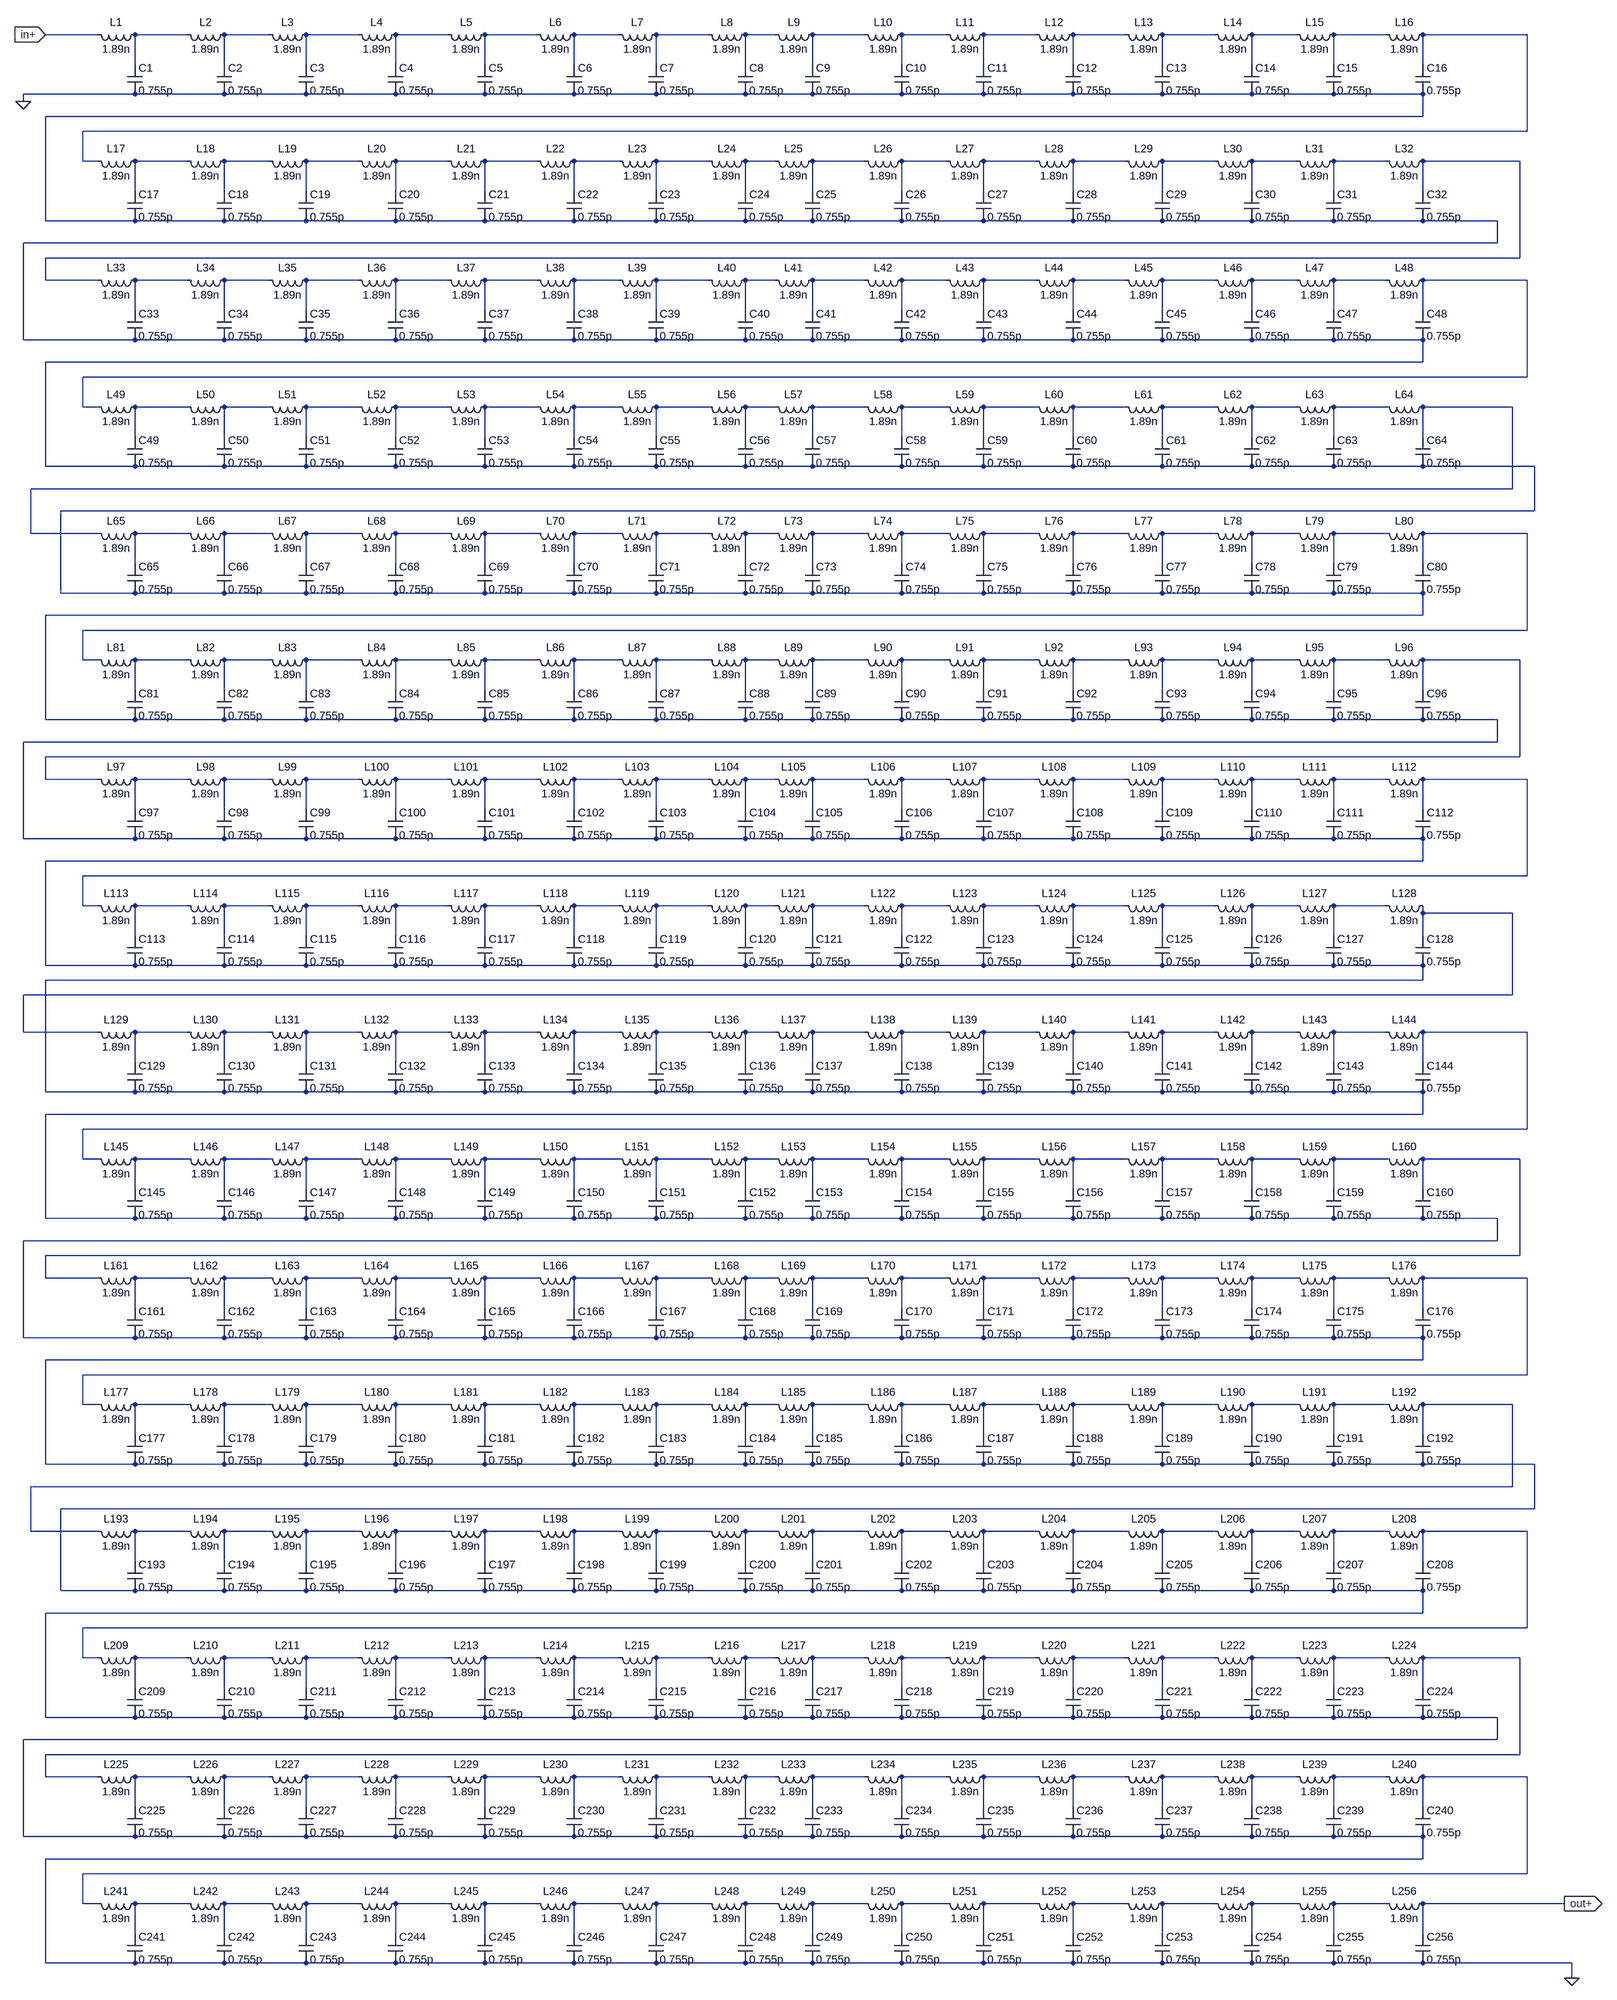
[diagram p0: schematic 10ns-delay.asc]
* 10ns-delay.asc
L1 N001 in+ 1.89n
C1 N001 0 0.755p
L2 N002 N001 1.89n
C2 N002 0 0.755p
L3 N003 N002 1.89n
C3 N003 0 0.755p
L4 N004 N003 1.89n
C4 N004 0 0.755p
L5 N005 N004 1.89n
C5 N005 0 0.755p
L6 N006 N005 1.89n
C6 N006 0 0.755p
L7 N007 N006 1.89n
C7 N007 0 0.755p
L8 N008 N007 1.89n
C8 N008 0 0.755p
L9 N009 N008 1.89n
C9 N009 0 0.755p
L10 N010 N009 1.89n
C10 N010 0 0.755p
L11 N011 N010 1.89n
C11 N011 0 0.755p
L12 N012 N011 1.89n
C12 N012 0 0.755p
L13 N013 N012 1.89n
C13 N013 0 0.755p
L14 N014 N013 1.89n
C14 N014 0 0.755p
L15 N015 N014 1.89n
C15 N015 0 0.755p
L16 N016 N015 1.89n
C16 N016 0 0.755p
L17 N017 N016 1.89n
C17 N017 0 0.755p
L18 N018 N017 1.89n
C18 N018 0 0.755p
L19 N019 N018 1.89n
C19 N019 0 0.755p
L20 N020 N019 1.89n
C20 N020 0 0.755p
L21 N021 N020 1.89n
C21 N021 0 0.755p
L22 N022 N021 1.89n
C22 N022 0 0.755p
L23 N023 N022 1.89n
C23 N023 0 0.755p
L24 N024 N023 1.89n
C24 N024 0 0.755p
L25 N025 N024 1.89n
C25 N025 0 0.755p
L26 N026 N025 1.89n
C26 N026 0 0.755p
L27 N027 N026 1.89n
C27 N027 0 0.755p
L28 N028 N027 1.89n
C28 N028 0 0.755p
L29 N029 N028 1.89n
C29 N029 0 0.755p
L30 N030 N029 1.89n
C30 N030 0 0.755p
L31 N031 N030 1.89n
C31 N031 0 0.755p
L32 N032 N031 1.89n
C32 N032 0 0.755p
L33 N033 N032 1.89n
C33 N033 0 0.755p
L34 N034 N033 1.89n
C34 N034 0 0.755p
L35 N035 N034 1.89n
C35 N035 0 0.755p
L36 N036 N035 1.89n
C36 N036 0 0.755p
L37 N037 N036 1.89n
C37 N037 0 0.755p
L38 N038 N037 1.89n
C38 N038 0 0.755p
L39 N039 N038 1.89n
C39 N039 0 0.755p
L40 N040 N039 1.89n
C40 N040 0 0.755p
L41 N041 N040 1.89n
C41 N041 0 0.755p
L42 N042 N041 1.89n
C42 N042 0 0.755p
L43 N043 N042 1.89n
C43 N043 0 0.755p
L44 N044 N043 1.89n
C44 N044 0 0.755p
L45 N045 N044 1.89n
C45 N045 0 0.755p
L46 N046 N045 1.89n
C46 N046 0 0.755p
L47 N047 N046 1.89n
C47 N047 0 0.755p
L48 N048 N047 1.89n
C48 N048 0 0.755p
L49 N049 N048 1.89n
C49 N049 0 0.755p
L50 N050 N049 1.89n
C50 N050 0 0.755p
L51 N051 N050 1.89n
C51 N051 0 0.755p
L52 N052 N051 1.89n
C52 N052 0 0.755p
L53 N053 N052 1.89n
C53 N053 0 0.755p
L54 N054 N053 1.89n
C54 N054 0 0.755p
L55 N055 N054 1.89n
C55 N055 0 0.755p
L56 N056 N055 1.89n
C56 N056 0 0.755p
L57 N057 N056 1.89n
C57 N057 0 0.755p
L58 N058 N057 1.89n
C58 N058 0 0.755p
L59 N059 N058 1.89n
C59 N059 0 0.755p
L60 N060 N059 1.89n
C60 N060 0 0.755p
L61 N061 N060 1.89n
C61 N061 0 0.755p
L62 N062 N061 1.89n
C62 N062 0 0.755p
L63 N063 N062 1.89n
C63 N063 0 0.755p
L64 N064 N063 1.89n
C64 N064 0 0.755p
L65 N065 N064 1.89n
C65 N065 0 0.755p
L66 N066 N065 1.89n
C66 N066 0 0.755p
L67 N067 N066 1.89n
C67 N067 0 0.755p
L68 N068 N067 1.89n
C68 N068 0 0.755p
L69 N069 N068 1.89n
C69 N069 0 0.755p
L70 N070 N069 1.89n
C70 N070 0 0.755p
L71 N071 N070 1.89n
C71 N071 0 0.755p
L72 N072 N071 1.89n
C72 N072 0 0.755p
L73 N073 N072 1.89n
C73 N073 0 0.755p
L74 N074 N073 1.89n
C74 N074 0 0.755p
L75 N075 N074 1.89n
C75 N075 0 0.755p
L76 N076 N075 1.89n
C76 N076 0 0.755p
L77 N077 N076 1.89n
C77 N077 0 0.755p
L78 N078 N077 1.89n
C78 N078 0 0.755p
L79 N079 N078 1.89n
C79 N079 0 0.755p
L80 N080 N079 1.89n
C80 N080 0 0.755p
L81 N081 N080 1.89n
C81 N081 0 0.755p
L82 N082 N081 1.89n
C82 N082 0 0.755p
L83 N083 N082 1.89n
C83 N083 0 0.755p
L84 N084 N083 1.89n
C84 N084 0 0.755p
L85 N085 N084 1.89n
C85 N085 0 0.755p
L86 N086 N085 1.89n
C86 N086 0 0.755p
L87 N087 N086 1.89n
C87 N087 0 0.755p
L88 N088 N087 1.89n
C88 N088 0 0.755p
L89 N089 N088 1.89n
C89 N089 0 0.755p
L90 N090 N089 1.89n
C90 N090 0 0.755p
L91 N091 N090 1.89n
C91 N091 0 0.755p
L92 N092 N091 1.89n
C92 N092 0 0.755p
L93 N093 N092 1.89n
C93 N093 0 0.755p
L94 N094 N093 1.89n
C94 N094 0 0.755p
L95 N095 N094 1.89n
C95 N095 0 0.755p
L96 N096 N095 1.89n
C96 N096 0 0.755p
L97 N097 N096 1.89n
C97 N097 0 0.755p
L98 N098 N097 1.89n
C98 N098 0 0.755p
L99 N099 N098 1.89n
C99 N099 0 0.755p
L100 N100 N099 1.89n
C100 N100 0 0.755p
L101 N101 N100 1.89n
C101 N101 0 0.755p
L102 N102 N101 1.89n
C102 N102 0 0.755p
L103 N103 N102 1.89n
C103 N103 0 0.755p
L104 N104 N103 1.89n
C104 N104 0 0.755p
L105 N105 N104 1.89n
C105 N105 0 0.755p
L106 N106 N105 1.89n
C106 N106 0 0.755p
L107 N107 N106 1.89n
C107 N107 0 0.755p
L108 N108 N107 1.89n
C108 N108 0 0.755p
L109 N109 N108 1.89n
C109 N109 0 0.755p
L110 N110 N109 1.89n
C110 N110 0 0.755p
L111 N111 N110 1.89n
C111 N111 0 0.755p
L112 N112 N111 1.89n
C112 N112 0 0.755p
L113 N113 N112 1.89n
C113 N113 0 0.755p
L114 N114 N113 1.89n
C114 N114 0 0.755p
L115 N115 N114 1.89n
C115 N115 0 0.755p
L116 N116 N115 1.89n
C116 N116 0 0.755p
L117 N117 N116 1.89n
C117 N117 0 0.755p
L118 N118 N117 1.89n
C118 N118 0 0.755p
L119 N119 N118 1.89n
C119 N119 0 0.755p
L120 N120 N119 1.89n
C120 N120 0 0.755p
L121 N121 N120 1.89n
C121 N121 0 0.755p
L122 N122 N121 1.89n
C122 N122 0 0.755p
L123 N123 N122 1.89n
C123 N123 0 0.755p
L124 N124 N123 1.89n
C124 N124 0 0.755p
L125 N125 N124 1.89n
C125 N125 0 0.755p
L126 N126 N125 1.89n
C126 N126 0 0.755p
L127 N127 N126 1.89n
C127 N127 0 0.755p
L128 N128 N127 1.89n
C128 N128 0 0.755p
L129 N129 N128 1.89n
C129 N129 0 0.755p
L130 N130 N129 1.89n
C130 N130 0 0.755p
L131 N131 N130 1.89n
C131 N131 0 0.755p
L132 N132 N131 1.89n
C132 N132 0 0.755p
L133 N133 N132 1.89n
C133 N133 0 0.755p
L134 N134 N133 1.89n
C134 N134 0 0.755p
L135 N135 N134 1.89n
C135 N135 0 0.755p
L136 N136 N135 1.89n
C136 N136 0 0.755p
L137 N137 N136 1.89n
C137 N137 0 0.755p
L138 N138 N137 1.89n
C138 N138 0 0.755p
L139 N139 N138 1.89n
C139 N139 0 0.755p
L140 N140 N139 1.89n
C140 N140 0 0.755p
L141 N141 N140 1.89n
C141 N141 0 0.755p
L142 N142 N141 1.89n
C142 N142 0 0.755p
L143 N143 N142 1.89n
C143 N143 0 0.755p
L144 N144 N143 1.89n
C144 N144 0 0.755p
L145 N145 N144 1.89n
C145 N145 0 0.755p
L146 N146 N145 1.89n
C146 N146 0 0.755p
L147 N147 N146 1.89n
C147 N147 0 0.755p
L148 N148 N147 1.89n
C148 N148 0 0.755p
L149 N149 N148 1.89n
C149 N149 0 0.755p
L150 N150 N149 1.89n
C150 N150 0 0.755p
L151 N151 N150 1.89n
C151 N151 0 0.755p
L152 N152 N151 1.89n
C152 N152 0 0.755p
L153 N153 N152 1.89n
C153 N153 0 0.755p
L154 N154 N153 1.89n
C154 N154 0 0.755p
L155 N155 N154 1.89n
C155 N155 0 0.755p
L156 N156 N155 1.89n
C156 N156 0 0.755p
L157 N157 N156 1.89n
C157 N157 0 0.755p
L158 N158 N157 1.89n
C158 N158 0 0.755p
L159 N159 N158 1.89n
C159 N159 0 0.755p
L160 N160 N159 1.89n
C160 N160 0 0.755p
L161 N161 N160 1.89n
C161 N161 0 0.755p
L162 N162 N161 1.89n
C162 N162 0 0.755p
L163 N163 N162 1.89n
C163 N163 0 0.755p
L164 N164 N163 1.89n
C164 N164 0 0.755p
L165 N165 N164 1.89n
C165 N165 0 0.755p
L166 N166 N165 1.89n
C166 N166 0 0.755p
L167 N167 N166 1.89n
C167 N167 0 0.755p
L168 N168 N167 1.89n
C168 N168 0 0.755p
L169 N169 N168 1.89n
C169 N169 0 0.755p
L170 N170 N169 1.89n
C170 N170 0 0.755p
L171 N171 N170 1.89n
C171 N171 0 0.755p
L172 N172 N171 1.89n
C172 N172 0 0.755p
L173 N173 N172 1.89n
C173 N173 0 0.755p
L174 N174 N173 1.89n
C174 N174 0 0.755p
L175 N175 N174 1.89n
C175 N175 0 0.755p
L176 N176 N175 1.89n
C176 N176 0 0.755p
L177 N177 N176 1.89n
C177 N177 0 0.755p
L178 N178 N177 1.89n
C178 N178 0 0.755p
L179 N179 N178 1.89n
C179 N179 0 0.755p
L180 N180 N179 1.89n
C180 N180 0 0.755p
L181 N181 N180 1.89n
C181 N181 0 0.755p
L182 N182 N181 1.89n
C182 N182 0 0.755p
L183 N183 N182 1.89n
C183 N183 0 0.755p
L184 N184 N183 1.89n
C184 N184 0 0.755p
L185 N185 N184 1.89n
C185 N185 0 0.755p
L186 N186 N185 1.89n
C186 N186 0 0.755p
L187 N187 N186 1.89n
C187 N187 0 0.755p
L188 N188 N187 1.89n
C188 N188 0 0.755p
L189 N189 N188 1.89n
C189 N189 0 0.755p
L190 N190 N189 1.89n
C190 N190 0 0.755p
L191 N191 N190 1.89n
C191 N191 0 0.755p
L192 N192 N191 1.89n
C192 N192 0 0.755p
L193 N193 N192 1.89n
C193 N193 0 0.755p
L194 N194 N193 1.89n
C194 N194 0 0.755p
L195 N195 N194 1.89n
C195 N195 0 0.755p
L196 N196 N195 1.89n
C196 N196 0 0.755p
L197 N197 N196 1.89n
C197 N197 0 0.755p
L198 N198 N197 1.89n
C198 N198 0 0.755p
L199 N199 N198 1.89n
C199 N199 0 0.755p
L200 N200 N199 1.89n
C200 N200 0 0.755p
L201 N201 N200 1.89n
C201 N201 0 0.755p
L202 N202 N201 1.89n
C202 N202 0 0.755p
L203 N203 N202 1.89n
C203 N203 0 0.755p
L204 N204 N203 1.89n
C204 N204 0 0.755p
L205 N205 N204 1.89n
C205 N205 0 0.755p
L206 N206 N205 1.89n
C206 N206 0 0.755p
L207 N207 N206 1.89n
C207 N207 0 0.755p
L208 N208 N207 1.89n
C208 N208 0 0.755p
L209 N209 N208 1.89n
C209 N209 0 0.755p
L210 N210 N209 1.89n
C210 N210 0 0.755p
L211 N211 N210 1.89n
C211 N211 0 0.755p
L212 N212 N211 1.89n
C212 N212 0 0.755p
L213 N213 N212 1.89n
C213 N213 0 0.755p
L214 N214 N213 1.89n
C214 N214 0 0.755p
L215 N215 N214 1.89n
C215 N215 0 0.755p
L216 N216 N215 1.89n
C216 N216 0 0.755p
L217 N217 N216 1.89n
C217 N217 0 0.755p
L218 N218 N217 1.89n
C218 N218 0 0.755p
L219 N219 N218 1.89n
C219 N219 0 0.755p
L220 N220 N219 1.89n
C220 N220 0 0.755p
L221 N221 N220 1.89n
C221 N221 0 0.755p
L222 N222 N221 1.89n
C222 N222 0 0.755p
L223 N223 N222 1.89n
C223 N223 0 0.755p
L224 N224 N223 1.89n
C224 N224 0 0.755p
L225 N225 N224 1.89n
C225 N225 0 0.755p
L226 N226 N225 1.89n
C226 N226 0 0.755p
L227 N227 N226 1.89n
C227 N227 0 0.755p
L228 N228 N227 1.89n
C228 N228 0 0.755p
L229 N229 N228 1.89n
C229 N229 0 0.755p
L230 N230 N229 1.89n
C230 N230 0 0.755p
L231 N231 N230 1.89n
C231 N231 0 0.755p
L232 N232 N231 1.89n
C232 N232 0 0.755p
L233 N233 N232 1.89n
C233 N233 0 0.755p
L234 N234 N233 1.89n
C234 N234 0 0.755p
L235 N235 N234 1.89n
C235 N235 0 0.755p
L236 N236 N235 1.89n
C236 N236 0 0.755p
L237 N237 N236 1.89n
C237 N237 0 0.755p
L238 N238 N237 1.89n
C238 N238 0 0.755p
L239 N239 N238 1.89n
C239 N239 0 0.755p
L240 N240 N239 1.89n
C240 N240 0 0.755p
L241 N241 N240 1.89n
C241 N241 0 0.755p
L242 N242 N241 1.89n
C242 N242 0 0.755p
L243 N243 N242 1.89n
C243 N243 0 0.755p
L244 N244 N243 1.89n
C244 N244 0 0.755p
L245 N245 N244 1.89n
C245 N245 0 0.755p
L246 N246 N245 1.89n
C246 N246 0 0.755p
L247 N247 N246 1.89n
C247 N247 0 0.755p
L248 N248 N247 1.89n
C248 N248 0 0.755p
L249 N249 N248 1.89n
C249 N249 0 0.755p
L250 N250 N249 1.89n
C250 N250 0 0.755p
L251 N251 N250 1.89n
C251 N251 0 0.755p
L252 N252 N251 1.89n
C252 N252 0 0.755p
L253 N253 N252 1.89n
C253 N253 0 0.755p
L254 N254 N253 1.89n
C254 N254 0 0.755p
L255 N255 N254 1.89n
C255 N255 0 0.755p
L256 out+ N255 1.89n
C256 out+ 0 0.755p
.backanno
.end